# EAGLE design KGM Feedback v2.1 (EAGLE 6.1)
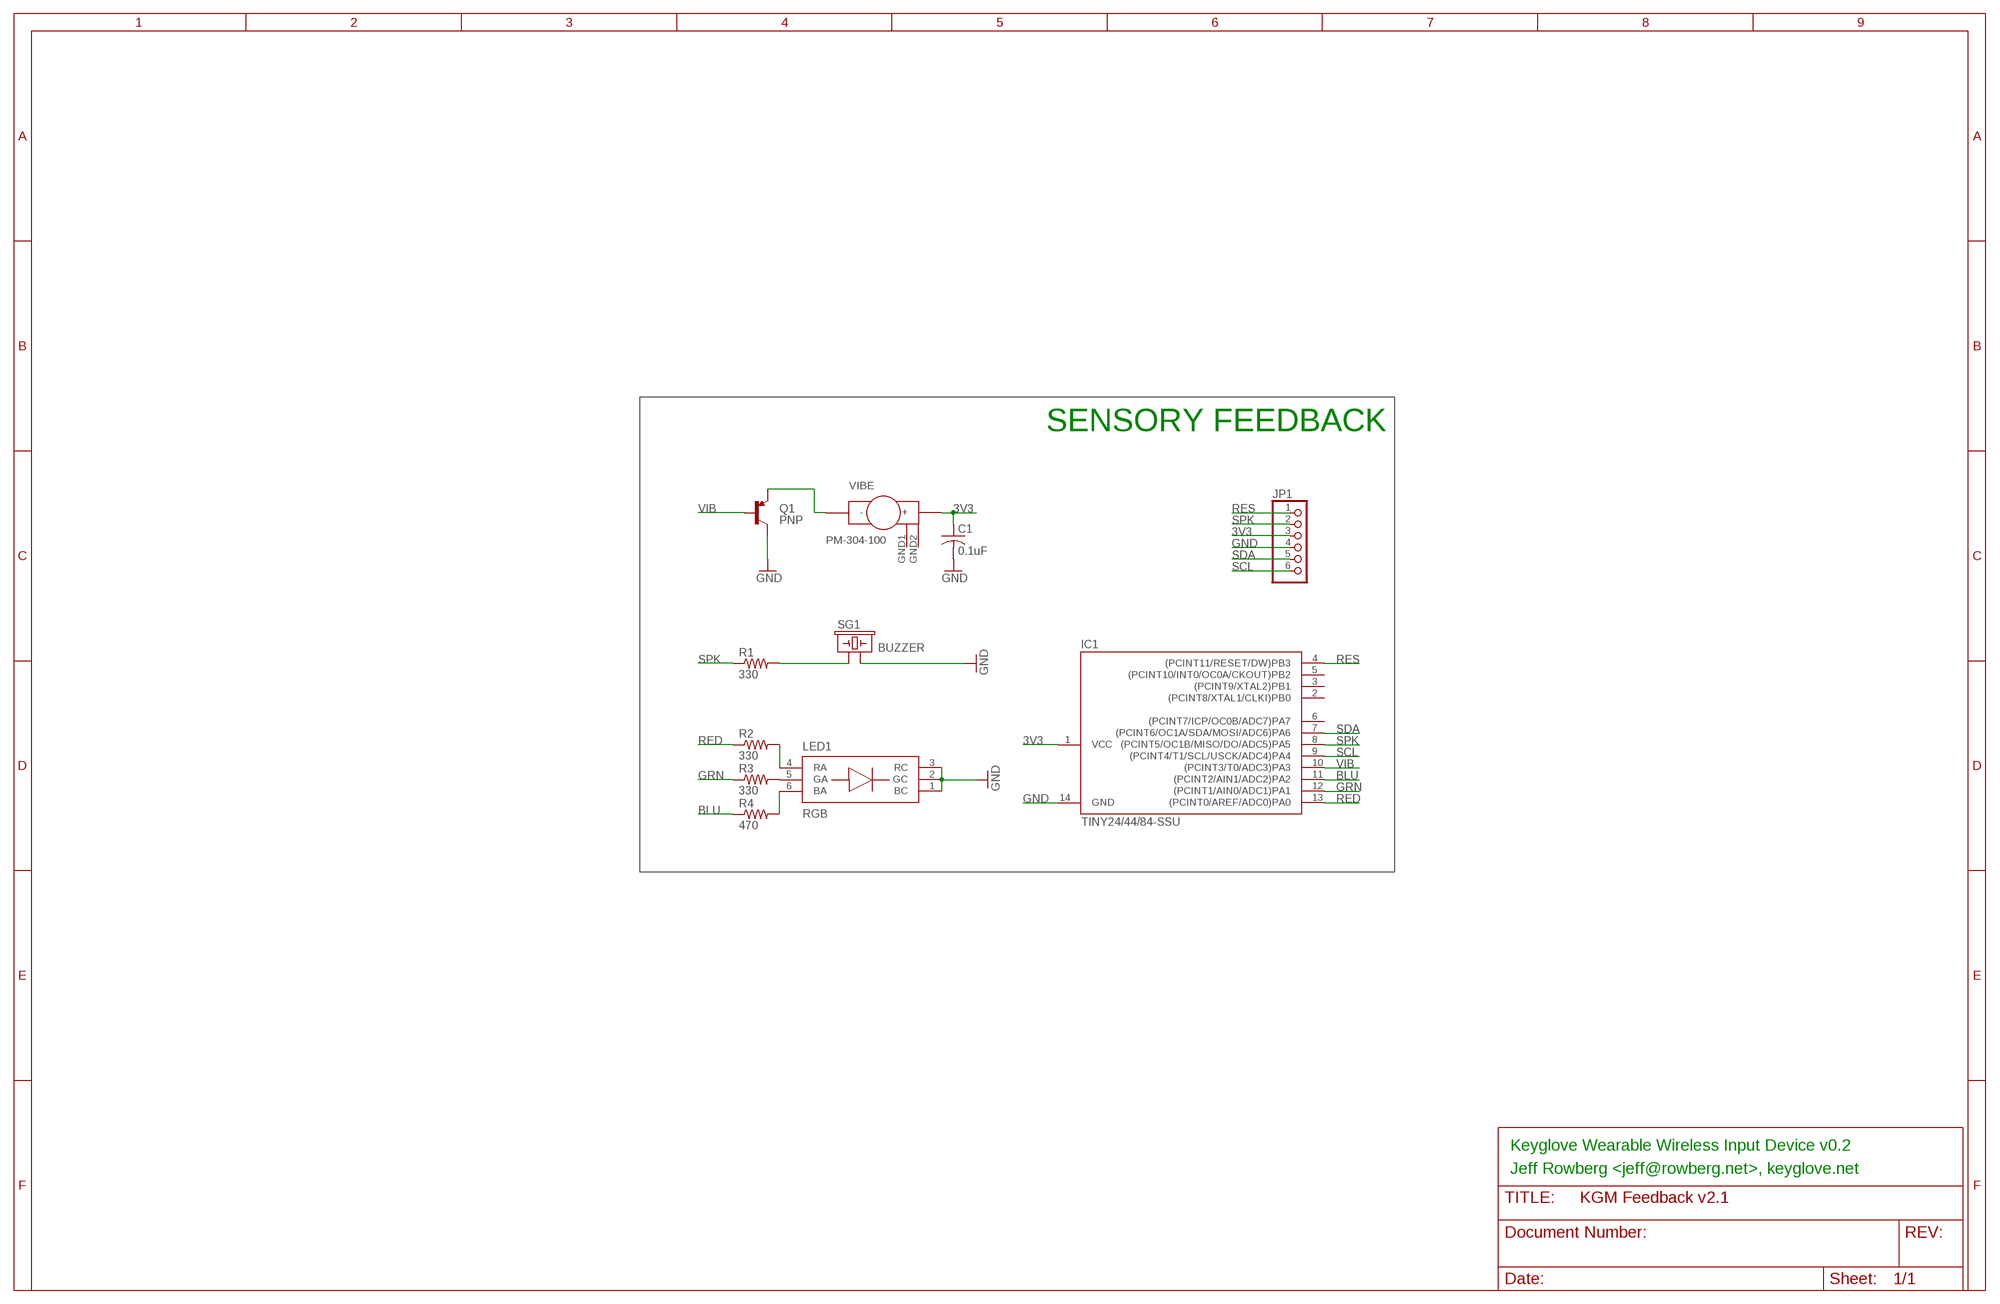
[diagram p0: schematic, sheet 1]

## Parts
C1  0.1uF  C-USC0603  [C0603]
IC1  TINY24/44/84-SSU  [SOIC14]
JP1  PINHD-1X6  [1X06]
LED1  RGB  ASMT-YTB2  [PLCC-6]
Q1  PNP  TRANSISTOR_PNPSMD  [SOT23-3]
R1  330  R-US_R0603  [R0603]
R2  330  R-US_R0603  [R0603]
R3  330  R-US_R0603  [R0603]
R4  470  R-US_R0603  [R0603]
SG1  BUZZER  BUZZERSMD3  [BUZZER-CMT1102]
VIBE  PM-304-100  [PM-304-100]

## Nets
3V3 [power]: C1.1 IC1.1(VCC) JP1.3 VIBE.+
BLU: IC1.11((PCINT2/AIN1/ADC2)PA2) R4.1
GND [power]: C1.2 IC1.14(GND) JP1.4 LED1.1(BC) LED1.2(GC) LED1.3(RC) Q1.3(C) SG1.2
GRN: IC1.12((PCINT1/AIN0/ADC1)PA1) R3.1
N$1: R1.2 SG1.1
N$2: LED1.5(GA) R3.2
N$3: LED1.4(RA) R2.2
N$4: LED1.6(BA) R4.2
N$15 [power]: Q1.2(E) VIBE.-
RED: IC1.13((PCINT0/AREF/ADC0)PA0) R2.1
RES: IC1.4((PCINT11/RESET/DW)PB3) JP1.1
SCL: IC1.9((PCINT4/T1/SCL/USCK/ADC4)PA4) JP1.6
SDA: IC1.7((PCINT6/OC1A/SDA/MOSI/ADC6)PA6) JP1.5
SPK: IC1.8((PCINT5/OC1B/MISO/DO/ADC5)PA5) JP1.2 R1.1
VIB: IC1.10((PCINT3/T0/ADC3)PA3) Q1.1(B)
Unconnected: IC1.2((PCINT8/XTAL1/CLKI)PB0) IC1.3((PCINT9/XTAL2)PB1) IC1.5((PCINT10/INT0/OC0A/CKOUT)PB2) IC1.6((PCINT7/ICP/OC0B/ADC7)PA7) VIBE.GND1(GND) VIBE.GND2(GND)

## Notes on the sheet
- SENSORY FEEDBACK
- Keyglove Wearable Wireless Input Device v0.2
- Jeff Rowberg <jeff@rowberg.net>, keyglove.net

## Library data of the parts
C1 = resistor:C-US: CAPACITOR, American symbol
IC1 = avr-7:TINY24/44/84
JP1 = sf-pinhead:PINHD-1X6: PIN HEADER
LED1 = sf-keyglove:ASMT-YTB2
Q1 = SparkFun:TRANSISTOR_PNP
R1-R4 = resistor:R-US_: RESISTOR, American symbol
SG1 = SparkFun:BUZZER: Buzzer 12mm Spark Fun Electronics SKU : Comp-Buzzer
VIBE = sf-keyglove:PM-304-100

## Net classes
0 default: width 0.152 mm, drill 0.305 mm, clearance 0.152 mm
1 power: width 0.254 mm, drill 0.305 mm, clearance 0.152 mm

## Board
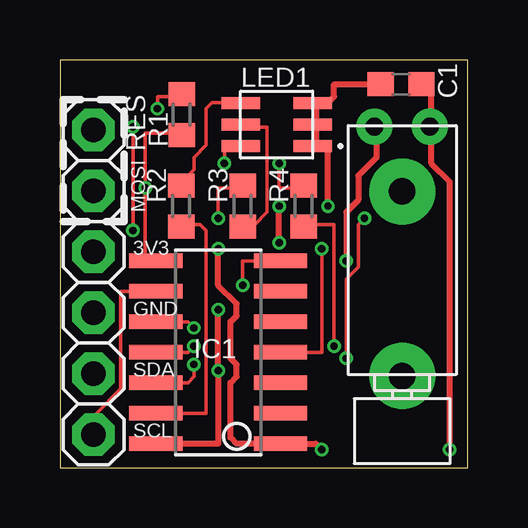
[diagram p1: board, top side]
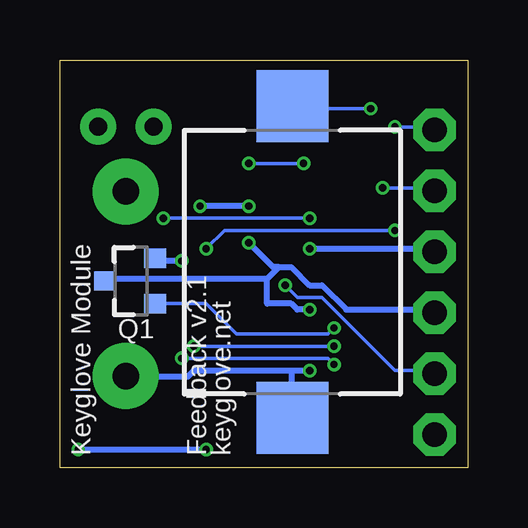
[diagram p2: board, bottom side, seen from below]

Size 17.02 x 17.02 mm. Coordinates in mm from the lower left corner, seen from the top.
Outline: 0,0 17.02,0 17.02,17.02 0,17.02 0,0
Copper layers (1*16): Top 0.0356mm / dielectric 1.5011mm / Bottom 0.0356mm
Design rules: minimum track width 6mil, minimum drill 12mil, track to track 6mil, track to pad 6mil, pad to pad 6mil, via to via 6mil, smd to smd 6mil, copper to edge 15mil, drill to drill 6mil, minimum pad ring 6mil, minimum via ring 5mil, stop-mask expansion 4mil, vias tented up to drill 20mil, thermal gap 10mil

### Footprints (pad centres in the part's own frame; a part is rotated, then mirrored left to right if it is on the bottom)
C0603 = smd 1.1 x 1: 1 -0.85,0; 2 0.85,0
SOIC14 = smd 0.61 x 2.21: 1 -3.81,-2.603; 2 -2.54,-2.603; 3 -1.27,-2.603; 4 0,-2.603; 5 1.27,-2.603; 6 2.54,-2.603; 7 3.81,-2.603; 8 3.81,2.603; 9 2.54,2.603; 10 1.27,2.603; 11 0,2.603; 12 -1.27,2.603; 13 -2.54,2.603; 14 -3.81,2.603
1X06 = drill 1.016 pad 1.778 octagon: 1 -6.35,0; 2 -3.81,0; 3 -1.27,0; 4 1.27,0; 5 3.81,0; 6 6.35,0
PLCC-6 = smd 1.6 x 0.5: 1 1.5,-0.9; 2 1.5,0; 3 1.5,0.9; 4 -1.5,0.9; 5 -1.5,0; 6 -1.5,-0.9
SOT23-3 = smd 0.8 x 0.9: 1 -0.95,-1; 2 0.95,-1; 3 0,1.1
R0603 = smd 1 x 1.1: 1 -0.85,0; 2 0.85,0
BUZZER-CMT1102 = smd 3 x 3: 1 -6.5,0; 2 6.5,0
PM-304-100 = drill 0.75 pad 1.5: + 2.7,-1.15; - 2.7,1.15 | drill 1.1 pad 2.75: GND1 0,0; GND2 -7.7,0

### Placement (x,y rotation side)
C1  14.22,16 180 top
IC1  6.6,4.83 90 top
JP1  1.4,7.75 270 top
LED1  9.03,14.32 0 top
Q1  14.05,7.8 90 bottom
R1  5.08,14.73 90 top
R2  5.05,10.92 90 top
R3  7.62,10.92 270 top
R4  10.16,10.92 90 top
SG1  7.32,8.59 270 bottom
VIBE  14.27,11.54 90 top

### Tracks (layer width: path | path; a pad name or v marks a point on that pad's centre or on a via)
3V3  (via drill 0.3)
  Top 0.254: C1.1 15.49,16 15.49,14.48 VIBE.+ 15.49,14.22 15.49,12.7 16.26,11.94 v16.26,0.76 | v6.6,9.14 6.6,7.62 7.37,6.86 7.37,6.35 7.11,6.1 7.11,4.57 7.37,4.32 7.37,3.81 7.11,3.56 7.11,1.27 7.37,1.02 IC1.1 10.67,1.02 v10.92,0.76
  Bottom 0.254: v6.6,9.14 1.52,9.14 JP1.3 | v10.92,0.76 v16.26,0.76
BLU  (via drill 0.3)
  Top 0.152: v11.43,5.08 11.43,10.16 10.16,10.16 R4.1 | v5.59,5.08 5.33,4.83 IC1.11
  Bottom 0.152: v5.59,5.08 v11.43,5.08
GND  (via drill 0.3)
  Top 0.254: C1.2 11.43,16 11.43,15.49 11.18,15.24 10.67,15.24 LED1.3 10.67,14.99 10.67,14.48 LED1.2 10.67,14.22 10.67,13.46 | IC1.14 6.6,1.02 v6.6,4.06 v6.6,6.6 | 10.67,13.46 11.18,13.46 v11.18,10.92 | v9.14,9.4 v9.14,10.92 | 10.67,13.46 LED1.1
  Bottom 0.254: 7.37,4.06 11.43,4.06 11.68,3.81 14.22,3.81 | 7.37,4.06 v6.6,4.06 | 7.37,4.06 7.37,2.29 SG1.2 | 7.87,8.38 7.37,8.38 6.6,7.62 6.1,7.62 5.08,6.6 1.52,6.6 JP1.4 | 8.38,7.87 7.87,8.38 | 8.38,7.87 8.38,6.86 7.37,6.86 7.11,6.6 v6.6,6.6 | 8.38,7.87 14.99,7.87 Q1.3 | v9.14,10.92 v11.18,10.92 | v9.14,9.4 8.13,8.38 7.87,8.38
GRN  (via drill 0.3)
  Top 0.152: v6.6,10.41 6.6,11.68 7.62,11.68 R3.1 | v12.7,10.41 12.45,10.16 12.45,8.38 11.94,7.87 v11.94,4.57 | v5.59,4.32 5.59,3.81 5.33,3.56 IC1.12
  Bottom 0.152: v12.7,10.41 v6.6,10.41 | v11.94,4.57 5.84,4.57 v5.59,4.32
N$1  (via drill 0.3)
  Top 0.152: v4.06,14.99 4.06,15.49 5.08,15.49 R1.2
  Bottom 0.152: v4.06,14.99 7.11,14.99 SG1.1
N$2
  Top 0.152: LED1.5 7.62,14.22 8.64,14.22 8.64,10.67 8.13,10.16 7.62,10.16 R3.2
N$3
  Top 0.152: R2.2 5.08,11.94 5.59,12.45 5.59,12.95 6.1,13.46 6.1,14.99 6.35,15.24 7.37,15.24 LED1.4
N$4  (via drill 0.3)
  Top 0.152: v9.14,12.7 9.14,11.68 10.16,11.68 R4.2 | v6.86,12.7 6.86,13.21 7.11,13.46 7.37,13.46 LED1.6
  Bottom 0.152: v6.86,12.7 v9.14,12.7
N$15  (via drill 0.3)
  Top 0.254: v11.94,8.64 11.94,10.67 12.45,11.18 12.45,12.19 13.21,12.95 13.21,14.22 VIBE.-
  Bottom 0.254: v11.94,8.64 12.95,8.64 Q1.2
RED
  Top 0.152: IC1.13 6.1,2.29 6.1,9.91 5.84,10.16 5.08,10.16 R2.1
RES  (via drill 0.3)
  Top 0.152: IC1.4 10.92,4.83 v10.92,9.14 | v3.05,14.22 v3.05,9.91
  Bottom 0.152: v10.92,9.14 10.16,9.91 v3.05,9.91 | v3.05,14.22 1.52,14.22 JP1.1
SCL
  Top 0.152: IC1.9 2.54,7.37 2.54,3.3 1.52,2.29 1.52,1.52 JP1.6
SDA  (via drill 0.3)
  Top 0.152: IC1.7 7.62,8.64 v7.62,7.62
  Bottom 0.152: v7.62,7.62 7.11,7.11 6.1,7.11 3.05,4.06 1.52,4.06 JP1.5
SPK  (via drill 0.3)
  Top 0.152: R1.1 5.08,13.97 3.56,13.97 v3.56,11.68 3.56,8.64 IC1.8
  Bottom 0.152: v3.56,11.68 1.52,11.68 JP1.2
VIB  (via drill 0.3)
  Top 0.152: v5.59,5.84 5.33,6.1 IC1.10
  Bottom 0.152: v5.59,5.84 5.84,5.59 9.65,5.59 10.92,6.86 12.95,6.86 Q1.1

### Text on the board
tPlace: RES | MOSI | 3V3 | GND | SDA | SCL
bPlace: keyglove.net | Feedback v2.1 | Keyglove Module